# Altium schematic sheet LAUNCHXL-F28377S_3.SchDoc: LAUNCHXL-F28377S.sch
size 301 x 237 mm; Date: 6/30/2015 1:27:57 PM; DocumentNumber: Document Number:; Revision: REV:; SheetNumber: 4
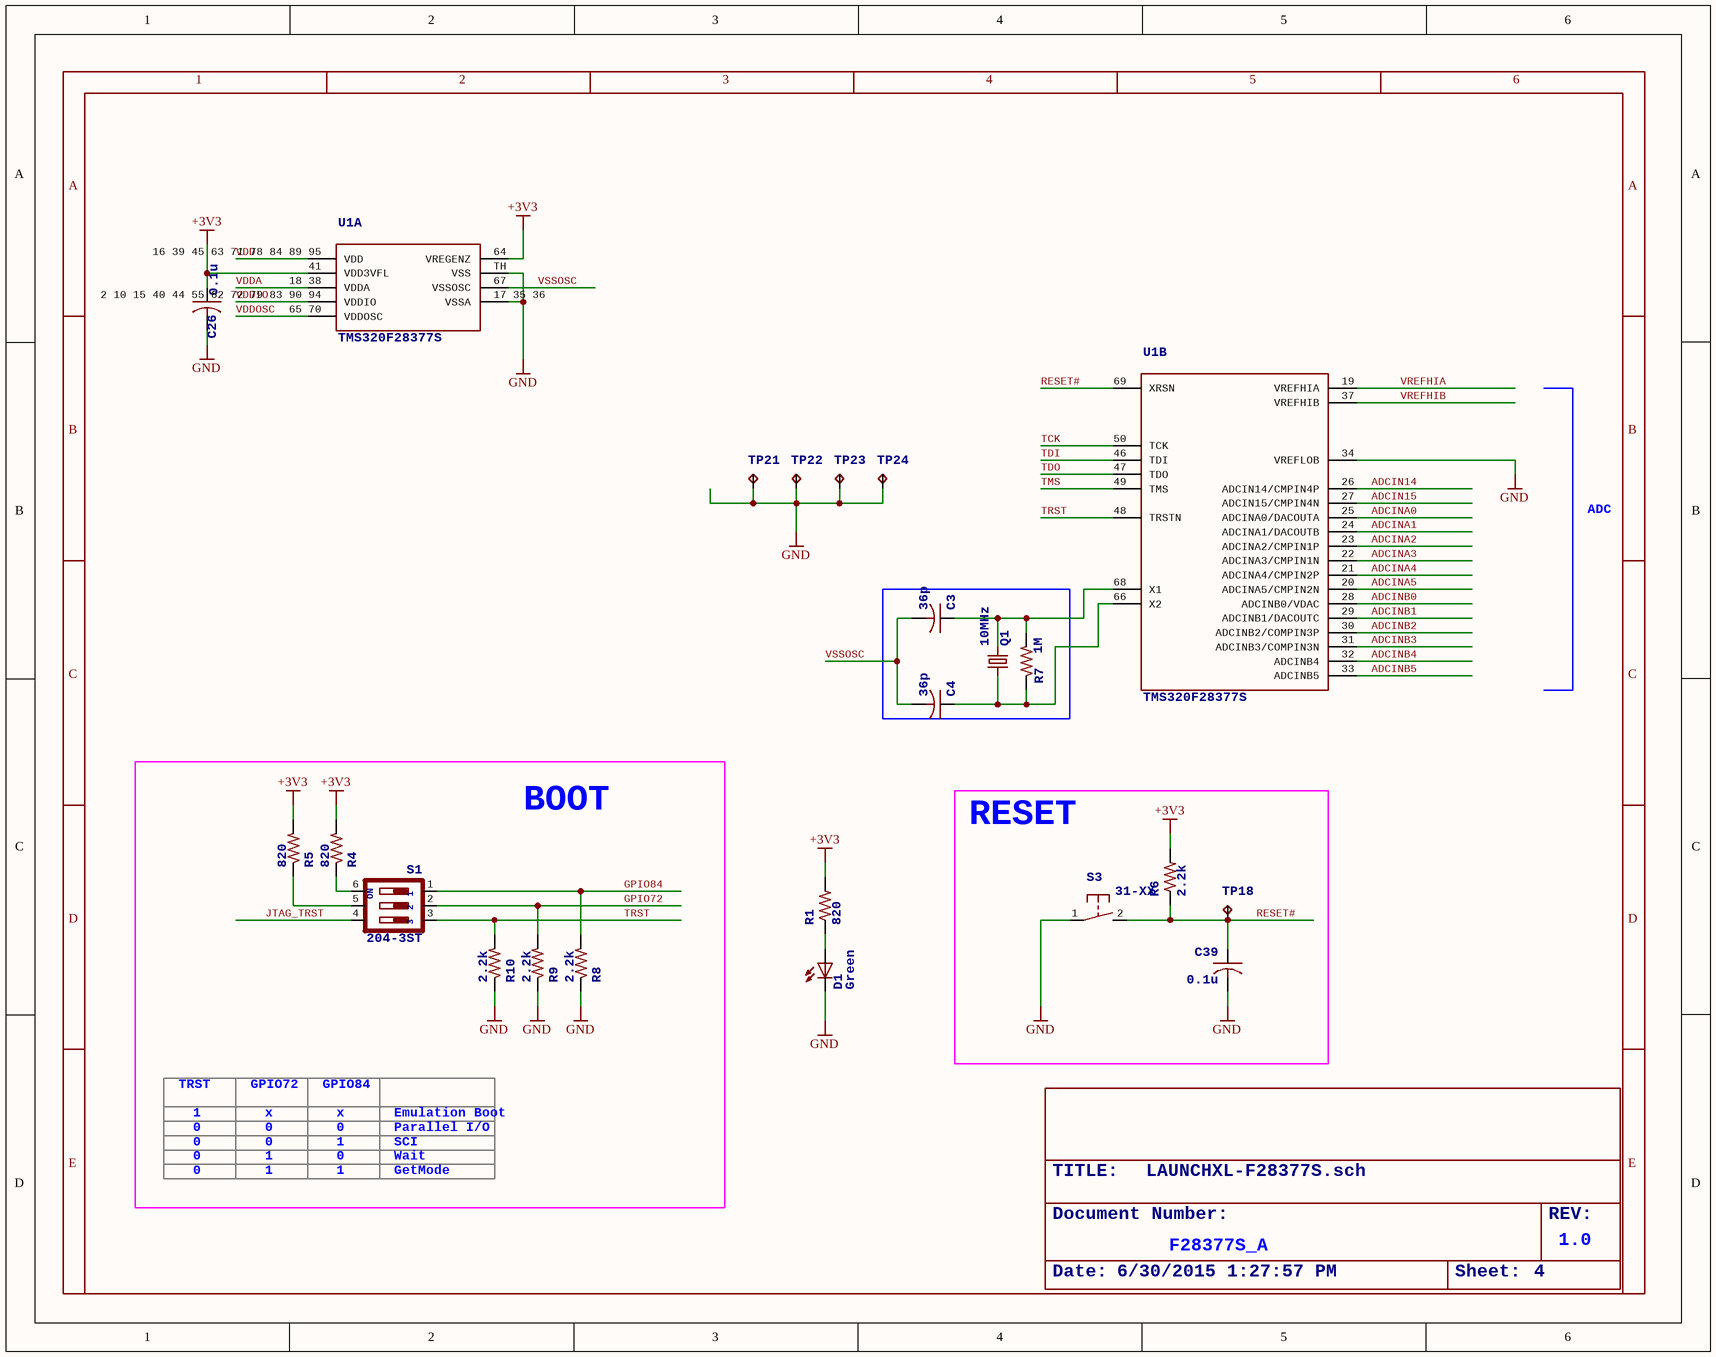
[diagram p0: LAUNCHXL-F28377S_3.SchDoc]

## Parts
C3  36p  [C0402]
C4  36p  [C0402]
C26  0.1u  [C0402]
C39  0.1u  [C0402]
D1  Green  [CHIP-LED0603]
Q1  10MHz  [HC49/S]
R1  820  [R0402]
R4  820  [R0402]
R5  820  [R0402]
R6  2.2k  [R0402]
R7  1M  [R0402]
R8  2.2k  [R0402]
R9  2.2k  [R0402]
R10  2.2k  [R0402]
S1  204-3ST  [CTS-219-03]
S3  31-XX  [B3F-31XX]
TP18  TESTPAD_TPB1,27  [TESTPAD_B1,27]  (value not drawn)
TP21  TESTPAD_TPB1,27  [TESTPAD_B1,27]  (value not drawn)
TP22  TESTPAD_TPB1,27  [TESTPAD_B1,27]  (value not drawn)
TP23  TESTPAD_TPB1,27  [TESTPAD_B1,27]  (value not drawn)
TP24  TESTPAD_TPB1,27  [TESTPAD_B1,27]  (value not drawn)
U1  TMS320F28377S  [PQFP100_THERMAL]  (parts A,B of 3)

## Blocks framed on the sheet
BOOT: R4 R5 R8-R10 S1
RESET: C39 R6 S3 TP18

## Nets
+3V3: C26.1 R1.2 R4.2 R5.2 R6.2 U1.41(VDD3VFL) U1.64(VREGENZ)
GND: C26.2 C39.2 D1.C R8.1 R9.1 R10.1 S3.1(P) TP21.TP TP22.TP TP23.TP TP24.TP U1.17_35_36(VSSA) U1.34(VREFLOB) U1.TH(VSS)
ADCIN14: U1.26(ADCIN14/CMPIN4P)
ADCIN15: U1.27(ADCIN15/CMPIN4N)
ADCINA0: U1.25(ADCINA0/DACOUTA)
ADCINA1: U1.24(ADCINA1/DACOUTB)
ADCINA2: U1.23(ADCINA2/CMPIN1P)
ADCINA3: U1.22(ADCINA3/CMPIN1N)
ADCINA4: U1.21(ADCINA4/CMPIN2P)
ADCINA5: U1.20(ADCINA5/CMPIN2N)
ADCINB0: U1.28(ADCINB0/VDAC)
ADCINB1: U1.29(ADCINB1/DACOUTC)
ADCINB2: U1.30(ADCINB2/COMPIN3P)
ADCINB3: U1.31(ADCINB3/COMPIN3N)
ADCINB4: U1.32(ADCINB4)
ADCINB5: U1.33(ADCINB5)
GPIO72: R9.2 S1.2
GPIO84: R8.2 S1.1
JTAG_TRST: S1.4
RESET#: C39.1 R6.1 S3.2(S) TP18.TP U1.69(XRSN)
TCK: U1.50(TCK)
TDI: U1.46(TDI)
TDO: U1.47(TDO)
TMS: U1.49(TMS)
TRST: R10.2 S1.3 U1.48(TRSTN)
VDD: U1.16_39_45_63_71_78_84_89_95(VDD)
VDDA: U1.18_38(VDDA)
VDDIO: U1.2_10_15_40_44_55_62_72_79_83_90_94(VDDIO)
VDDOSC: U1.65_70(VDDOSC)
VREFHIA: U1.19(VREFHIA)
VREFHIB: U1.37(VREFHIB)
VSSOSC: C3.2 C4.2 U1.67(VSSOSC)
NetC3_1: C3.1 Q1.2 R7.2 U1.68(X1)
NetC4_1: C4.1 Q1.1 R7.1 U1.66(X2)
NetD1_A: D1.A R1.1
NetR4_1: R4.1 S1.6
NetR5_1: R5.1 S1.5

## Notes on the sheet
- ADC
- TRST
- GPIO72
- GPIO84
- 1
- 0
- x
- Emulation Boot
- Parallel I/O
- SCI
- Wait
- GetMode
- F28377S_A
- 1.0
- 2
- 3
- 4
- 5
- 6
- A
- B
- C
- D
- E

## Library data of the parts
C3 C4 C26 C39 = C-USC0402: <B>CAPACITOR</B>, American symbol
D1 = LEDCHIP-LED0603: <b>LED</b><p> / <u>OSRAM</u>:<br> / - <u>CHIPLED</u><br> / LG R971, LG N971, LY N971, LG Q971, LY Q971, LO R971, LY R971 / LH N974, LH R974<br> / LS Q976, LO Q976, LY Q976<br> / LO Q996<br> / - <u>Hyper CHIPLED</u><br> / LW Q18S<br> / LB Q993, LB Q99A, LB R99A<br> / - <u>SideLED</u><br> / LS A670, LO A670, LY A670, LG A670, LP A670<br> / LB A673, LV A673, LT A673, LW A673<br> / LH A674<br> / LY A675<br> / LS A676, LA A676, LO A676, LY A676, LW A676<br> / LS A679, LY A679, LG A679<br> / -  <u>Hyper Micro SIDELED®</u><br> / LS Y876, LA Y876, LO Y876, LY Y876<br> / LT Y87S<br> / - <u>SmartLED</u><br> / LW L88C, LW L88S<br> / LB L89C, LB L89S, LG L890<br> / LS L89K, LO L89K, LY L89K<br> / LS L896, LA L896, LO L896, LY L896<br> / - <u>TOPLED</u><br> / LS T670, LO T670, LY T670, LG T670, LP T670<br> / LSG T670, LSP T670, LSY T670, LOP T670, LYG T670<br> / LG T671, LOG T671, LSG T671<br> / LB T673, LV T673, LT T673, LW T673<br> / LH T674<br> / LS T676, LA T676, LO T676, LY T676, LB T676, LH T676, LSB T676, LW T676<br> / LB T67C, LV T67C, LT T67C, LS T67K, LO T67K, LY T67K, LW E67C<br> / LS E67B, LA E67B, LO E67B, LY E67B, LB E67C, LV E67C, LT E67C<br> / LW T67C<br> / LS T679, LY T679, LG T679<br> / LS T770, LO T770, LY T770, LG T770, LP T770<br> / LB T773, LV T773, LT T773, LW T773<br> / LH T774<br> / LS E675, LA E675, LY E675, LS T675<br> / LS T776, LA T776, LO T776, LY T776, LB T776<br> / LHGB T686<br> / LT T68C, LB T68C<br> / - <u>Hyper Mini TOPLED®</u><br> / LB M676<br> / - <u>Mini TOPLED Santana®</u><br> / LG M470<br> / LS M47K, LO M47K, LY M47K / <p> / Source: http://www.osram.convergy.de<p> / <u>LUXEON:</u><br> / - <u>LUMILED®</u><br> / LXK2-PW12-R00, LXK2-PW12-S00, LXK2-PW14-U00, LXK2-PW14-V00<br> / LXK2-PM12-R00, LXK2-PM12-S00, LXK2-PM14-U00<br> / LXK2-PE12-Q00, LXK2-PE12-R00, LXK2-PE12-S00, LXK2-PE14-T00, LXK2-PE14-U00<br> / LXK2-PB12-K00, LXK2-PB12-L00, LXK2-PB12-M00, LXK2-PB14-N00, LXK2-PB14-P00, LXK2-PB14-Q00<br> / LXK2-PR12-L00, LXK2-PR12-M00, LXK2-PR14-Q00, LXK2-PR14-R00<br> / LXK2-PD12-Q00, LXK2-PD12-R00, LXK2-PD12-S00<br> / LXK2-PH12-R00, LXK2-PH12-S00<br> / LXK2-PL12-P00, LXK2-PL12-Q00, LXK2-PL12-R00 / <p> / Source: www.luxeon.com<p> / <u>KINGBRIGHT:</U><p> / KA-3528ASYC<br> / Source: www.kingbright.com
Q1 = CRYSTALHC49S: <b>CRYSTAL</b>
R1 R4-R10 = R-US_R0402: <B>RESISTOR</B>, American symbol
S1 = 219-03*: <b>Surface Mount DIP Switch Series 219 SMT</b><p> / CTS Electronic Components<br> / Sourc: www.ctscorp.com; OC_FARNELL: unknown; OC_NEWARK: unknown; 1: 1; 2: 2; 3: 3; ON: ON
S3 = 31-XX: <b>OMRON SWITCH</b>; MPN: B3F-3100; OC_FARNELL: 959704; OC_NEWARK: 36M3582
TP18 TP21-TP24 = TESTPAD_TPB1,27: <b>Test pad</b>